# EAGLE design SwBotMain (EAGLE 6.3)
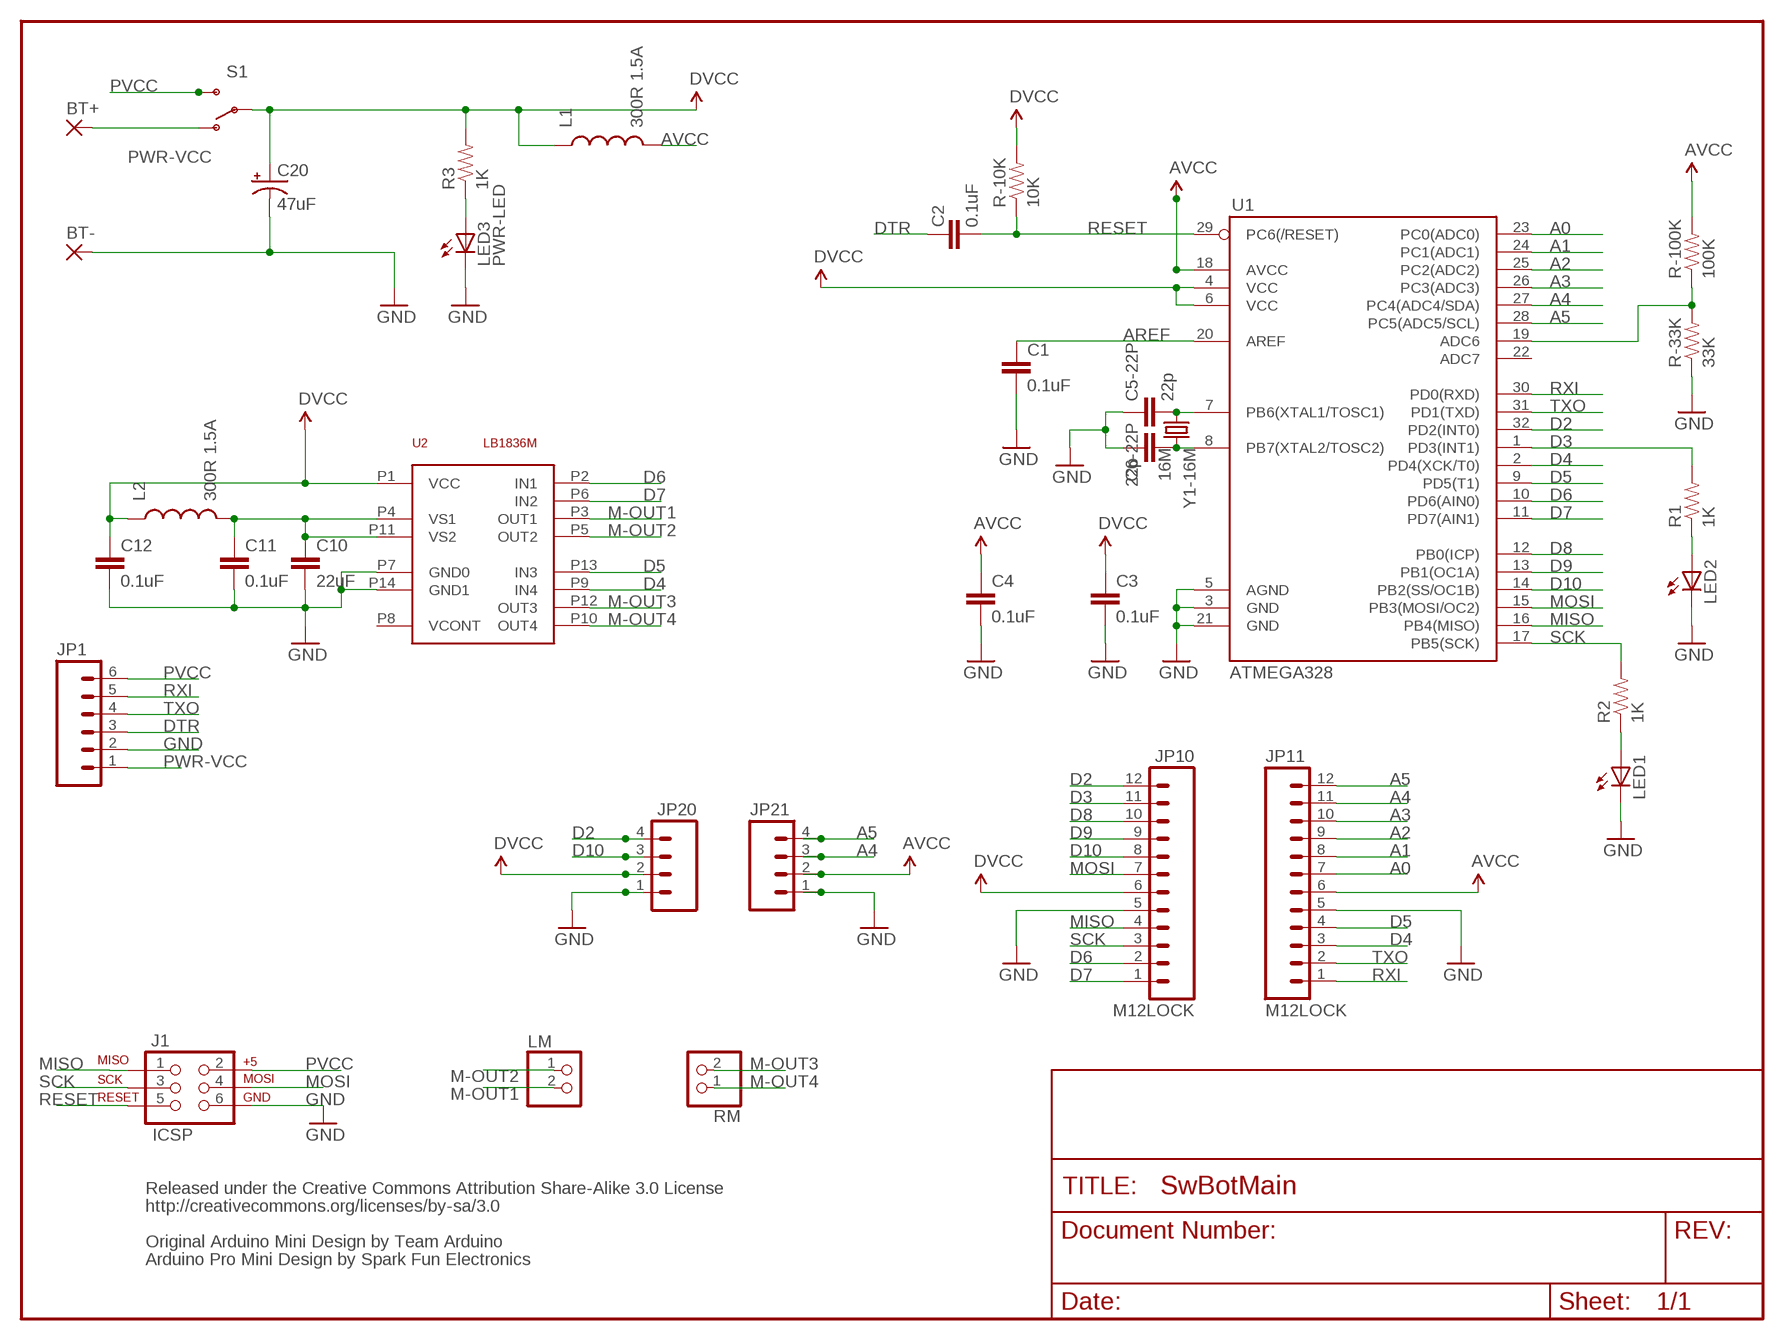
[diagram p0: schematic, sheet 1]

## Parts
BT+  SMD2  [SMD1,27-2,54]
BT-  SMD2  [SMD1,27-2,54]
C1  0.1uF  CAP0805  [0805]
C2  0.1uF  CAP0805  [0805]
C3  0.1uF  CAP0805  [0805]
C4  0.1uF  CAP0805  [0805]
C5-22P  22p  CAP0805  [0805]
C6-22P  22p  CAP0805  [0805]
C10  22uF  CAP1206  [1206]
C11  0.1uF  CAP0805  [0805]
C12  0.1uF  CAP0805  [0805]
C20  47uF  47UF-TANT  [EIA3528]
J1  ICSP  AVR_SPI_PRG_62X3_LOCK  [2X3_LOCK]
JP1  M06LOCK  [1X06_LOCK]
JP10  M12LOCK  [1X12_LOCK]
JP11  M12LOCK  [1X12_LOCK]
JP20  M04LOCK_LONGPADS  [1X04_LOCK_LONGPADS]
JP21  M04LOCK_LONGPADS  [1X04_LOCK_LONGPADS]
L1  300R 1.5A  INDUCTOR0805  [0805]
L2  300R 1.5A  INDUCTOR0805  [0805]
LED1  LEDCHIP-LED0805  [CHIP-LED0805]
LED2  LEDCHIP-LED0805  [CHIP-LED0805]
LED3  PWR-LED  LED5MM  [LED5MM]
LM  PINHD-1X2  [1X02]
R1  1K  RESISTOR0805-RES  [0805]
R2  1K  RESISTOR0805-RES  [0805]
R3  1K  RESISTOR0805-RES  [0805]
R-10K  10K  RESISTOR0805-RES  [0805]
R-33K  33K  RESISTOR0805-RES  [0805]
R-100K  100K  RESISTOR0805-RES  [0805]
RM  PINHD-1X2  [1X02]
S1  SWITCH-SPDTPTH_LOCK  [SWITCH-SPDT_LOCK.007S]
U1  ATMEGA328  ATMEGA168  [TQFP32-08]
U2  LB1836M  [MFP14S]
Y1-16M  16M  CRYSTALTXC-7A  [CRYSTAL-TXC-7A]

## Nets
A0: JP11.7 U1.23(PC0(ADC0))
A1: JP11.8 U1.24(PC1(ADC1))
A2: JP11.9 U1.25(PC2(ADC2))
A3: JP11.10 U1.26(PC3(ADC3))
A4: JP11.11 JP21.3 U1.27(PC4(ADC4/SDA))
A5: JP11.12 JP21.4 U1.28(PC5(ADC5/SCL))
AREF: C1.1 U1.20(AREF)
AVCC [vcc]: C4.1 JP11.6 JP21.2 L1.2 R-100K.2 U1.18(AVCC)
D2: JP10.12 JP20.4 U1.32(PD2(INT0))
D3: JP10.11 R1.2 U1.1(PD3(INT1))
D4: JP11.3 U1.2(PD4(XCK/T0)) U2.P9(IN4)
D5: JP11.4 U1.9(PD5(T1)) U2.P13(IN3)
D6: JP10.2 U1.10(PD6(AIN0)) U2.P2(IN1)
D7: JP10.1 U1.11(PD7(AIN1)) U2.P6(IN2)
D8: JP10.10 U1.12(PB0(ICP))
D9: JP10.9 U1.13(PB1(OC1A))
D10: JP10.8 JP20.3 U1.14(PB2(SS/OC1B))
DTR: C2.2 JP1.3
DVCC [vcc]: C3.1 C12.1 C20.A(+) JP10.6 JP20.2 L1.1 L2.1 R3.2 R-10K.2 S1.2(P) U1.4(VCC) U1.6(VCC) U2.P1(VCC)
GND [vcc]: BT-.1(P) C1.2 C3.2 C4.2 C5-22P.1 C6-22P.2 C10.2 C11.2 C12.2 C20.C(-) J1.6 JP1.2 JP10.5 JP11.5 JP20.1 JP21.1 LED1.C LED2.C LED3.K(C) R-33K.1 U1.3(GND) U1.5(AGND) U1.21(GND) U2.P7(GND0) U2.P14(GND1)
M-OUT1 [HighCur]: LM.2 U2.P3(OUT1)
M-OUT2 [HighCur]: LM.1 U2.P5(OUT2)
M-OUT3 [HighCur]: RM.2 U2.P12(OUT3)
M-OUT4 [HighCur]: RM.1 U2.P10(OUT4)
MISO: J1.1 JP10.4 U1.16(PB4(MISO))
MOSI: J1.4 JP10.7 U1.15(PB3(MOSI/OC2))
N$1: C6-22P.1 U1.8(PB7(XTAL2/TOSC2)) Y1-16M.P$2
N$2: C5-22P.2 U1.7(PB6(XTAL1/TOSC1)) Y1-16M.P$1
N$3: LED2.A R1.1
N$4: LED3.A R3.1
N$5 [vcc]: C10.1 C11.1 L2.2 U2.P4(VS1) U2.P11(VS2)
N$6: R-33K.2 R-100K.1 U1.19(ADC6)
N$7: LED1.A R2.1
PVCC [vcc]: J1.2 JP1.6 S1.3(S)
PWR-VCC [vcc]: BT+.1(P) JP1.1 S1.1(O)
RESET: C2.1 J1.5 R-10K.1 U1.29(PC6(/RESET))
RXI: JP1.5 JP11.1 U1.30(PD0(RXD))
SCK: J1.3 JP10.3 R2.2 U1.17(PB5(SCK))
TXO: JP1.4 JP11.2 U1.31(PD1(TXD))
Unconnected: U1.22(ADC7) U2.P8(VCONT)

## Notes on the sheet
- Released under the Creative Commons Attribution Share-Alike 3.0 License
- http://creativecommons.org/licenses/by-sa/3.0
- Original Arduino Mini Design by Team Arduino
- Arduino Pro Mini Design by Spark Fun Electronics

## Library data of the parts
BT+ BT- = wirepad:SMD2: SMD PAD
C1 C3 C4 C5-22P C6-22P C10-C12 = SparkFun-Capacitors:CAP: Capacitor Standard 0603 ceramic capacitor, and 0.1" leaded capacitor.
C2 = SparkFun:CAP: Capacitor Standard 0603 ceramic capacitor, and 0.1" leaded capacitor.
C20 = SparkFun-Capacitors:47UF-TANT: 47uF Tantalum SMT CAP-08310- 10V 10% (EIA-3528); PROD_ID: CAP-08310
J1 = SparkFun-Connectors:AVR_SPI_PRG_6: AVR ISP 6 Pin This is the reduced ISP connector for AVR programming. Common on Arduino. This footprint will take up less PCB space and can be used with a 10-pin to 6-pin adapter such as SKU: BOB-08508
JP1 = SparkFun-Connectors:M06: Header 6 Standard 6-pin 0.1" header. Use with straight break away headers (SKU : PRT-00116), right angle break away headers (PRT-00553), swiss pins (PRT-00743), machine pins (PRT-00117), and female headers (PRT-00115). Molex polarized connector foot print use with SKU : PRT-08094 with associated crimp pins and housings. NOTES ON THE VARIANTS LOCK and LOCK_LONGPADS... This footprint was designed to help hold the alignment of a through-hole component (i.e. 6-pin header) while soldering it into place. You may notice that each hole has been shifted either up or down by 0.005 of an inch from it's more standard position (which is a perfectly straight line). This slight alteration caused the pins (the squares in the middle) to touch the edges of the holes. Because they are alternating, it causes a "brace" to hold the component in place. 0.005 has proven to be the perfect amount of "off-center" position when using our standard breakaway headers. Although looks a little odd when you look at the bare footprint, once you have a header in there, the alteration is very hard to notice. Also, if you push a header all the way into place, it is covered up entirely on the bottom side. This idea of altering the position of holes to aid alignment will be further integrated into the Sparkfun Library for other footprints. It can help hold any component with 3 or more connection pins.
JP10 JP11 = SparkFun-Connectors:M12: Header 12 Standard 12-pin 0.1" header. Use with straight break away headers (SKU : PRT-00116), right angle break away headers (PRT-00553), swiss pins (PRT-00743), machine pins (PRT-00117), and female headers (PRT-00115).
JP20 JP21 = SparkFun-Connectors:M04: Header 4 Standard 4-pin 0.1" header. Use with straight break away headers (SKU : PRT-00116), right angle break away headers (PRT-00553), swiss pins (PRT-00743), machine pins (PRT-00117), and female headers (PRT-00115). Molex polarized connector foot print use with SKU : PRT-08231 with associated crimp pins and housings. 1MM SMD Version SKU: PRT-10208
L1 L2 = SparkFun-Passives:INDUCTOR: Inductors Basic Inductor/Choke - 0603 and 1206. Footprints are not proven and vary greatly between part numbers.
LED1 LED2 = led:LED: LED OSRAM: - CHIPLED LG R971, LG N971, LY N971, LG Q971, LY Q971, LO R971, LY R971 LH N974, LH R974 LS Q976, LO Q976, LY Q976 LO Q996 - Hyper CHIPLED LW Q18S LB Q993, LB Q99A, LB R99A - SideLED LS A670, LO A670, LY A670, LG A670, LP A670 LB A673, LV A673, LT A673, LW A673 LH A674 LY A675 LS A676, LA A676, LO A676, LY A676, LW A676 LS A679, LY A679, LG A679 - Hyper Micro SIDELED® LS Y876, LA Y876, LO Y876, LY Y876 LT Y87S - SmartLED LW L88C, LW L88S LB L89C, LB L89S, LG L890 LS L89K, LO L89K, LY L89K LS L896, LA L896, LO L896, LY L896 - TOPLED LS T670, LO T670, LY T670, LG T670, LP T670 LSG T670, LSP T670, LSY T670, LOP T670, LYG T670 LG T671, LOG T671, LSG T671 LB T673, LV T673, LT T673, LW T673 LH T674 LS T676, LA T676, LO T676, LY T676, LB T676, LH T676, LSB T676, LW T676 LB T67C, LV T67C, LT T67C, LS T67K, LO T67K, LY T67K, LW E67C LS E67B, LA E67B, LO E67B, LY E67B, LB E67C, LV E67C, LT E67C LW T67C LS T679, LY T679, LG T679 LS T770, LO T770, LY T770, LG T770, LP T770 LB T773, LV T773, LT T773, LW T773 LH T774 LS E675, LA E675, LY E675, LS T675 LS T776, LA T776, LO T776, LY T776, LB T776 LHGB T686 LT T68C, LB T68C - Hyper Mini TOPLED® LB M676 - Mini TOPLED Santana® LG M470 LS M47K, LO M47K, LY M47K Source: http://www.osram.convergy.de LUXEON: - LUMILED® LXK2-PW12-R00, LXK2-PW12-S00, LXK2-PW14-U00, LXK2-PW14-V00 LXK2-PM12-R00, LXK2-PM12-S00, LXK2-PM14-U00 LXK2-PE12-Q00, LXK2-PE12-R00, LXK2-PE12-S00, LXK2-PE14-T00, LXK2-PE14-U00 LXK2-PB12-K00, LXK2-PB12-L00, LXK2-PB12-M00, LXK2-PB14-N00, LXK2-PB14-P00, LXK2-PB14-Q00 LXK2-PR12-L00, LXK2-PR12-M00, LXK2-PR14-Q00, LXK2-PR14-R00 LXK2-PD12-Q00, LXK2-PD12-R00, LXK2-PD12-S00 LXK2-PH12-R00, LXK2-PH12-S00 LXK2-PL12-P00, LXK2-PL12-Q00, LXK2-PL12-R00 Source: www.luxeon.com KINGBRIGHT: KA-3528ASYC Source: www.kingbright.com
LED3 = SparkFun-LED:LED: LEDs Standard schematic elements and footprints for 5mm, 3mm, 1206, and 0603 sized LEDs. 5mm - Spark Fun Electronics SKU : COM-00529 (and others)
LM RM = pinhead:PINHD-1X2: PIN HEADER
R1-R3 R-10K R-33K R-100K = SparkFun-Passives:RESISTOR: Resistor Basic schematic elements and footprints for 0603, 1206, and PTH resistors.
S1 = SparkFun-Electromechanical:SWITCH-SPDT: SPST Switch Simple slide switch. Spark Fun Electronics SKU : COM-00102
U1 = SparkFun:ATMEGA168
U2 = LeoBuild:LB1836M
Y1-16M = SparkFun-FreqCtrl:CRYSTAL: Various standard crystals. Proven footprints. Spark Fun Electronics SKU : COM-00534

## Net classes
0 default: width 0.203 mm
1 vcc: width 0.406 mm
2 HighCur: width 0.406 mm

## Board
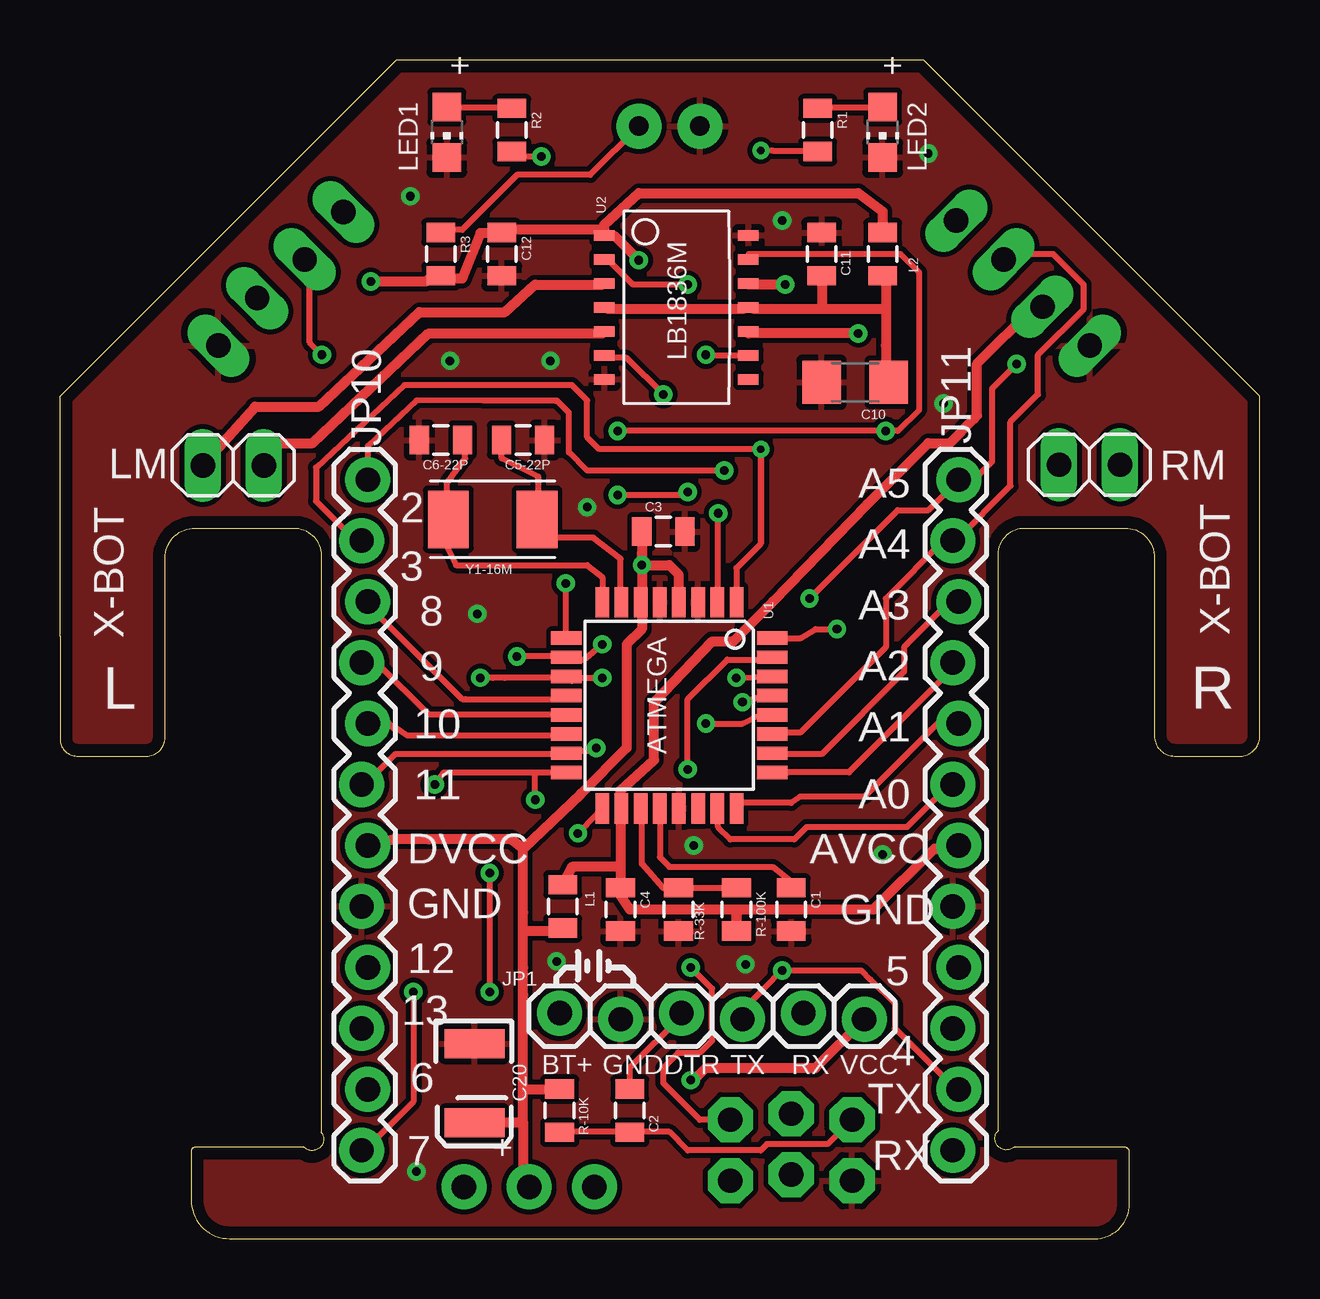
[diagram p1: board, top side]
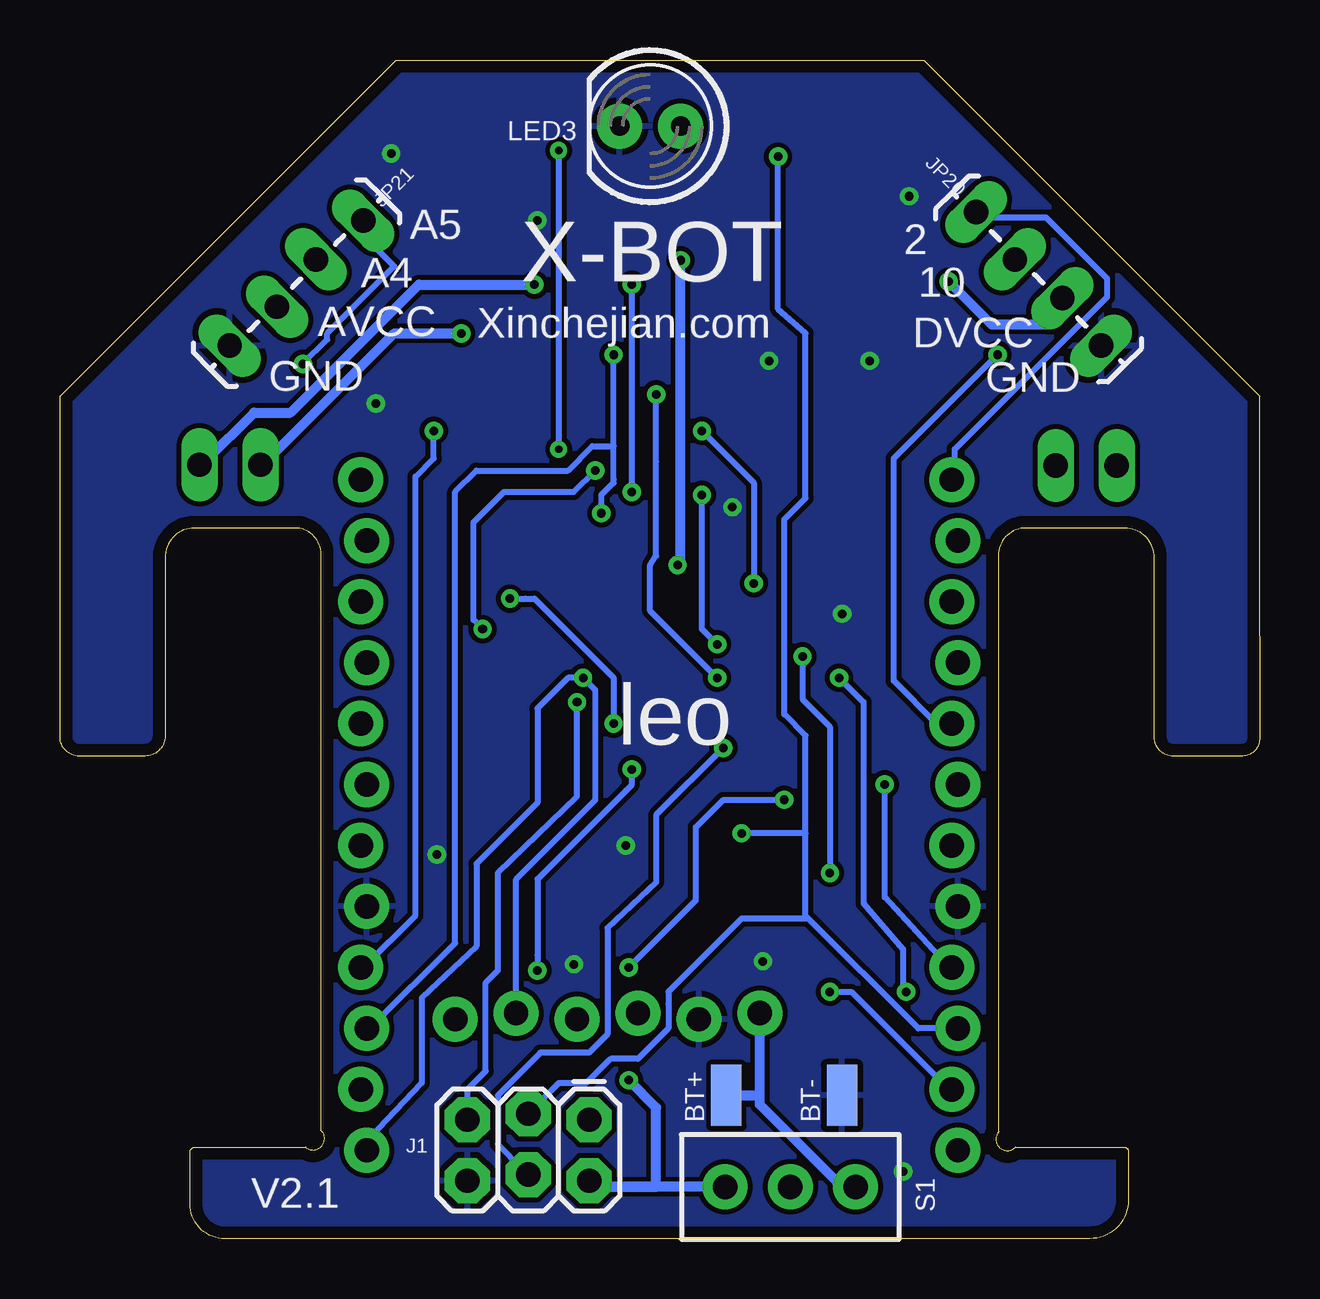
[diagram p2: board, bottom side, seen from below]

Size 50 x 49.11 mm. Coordinates in mm from the lower left corner, seen from the top.
Outline: 39.12,4.51 39.12,28.52 arc-90 40.21,29.61 44.39,29.61 arc-90 45.62,28.38 45.62,26.11 45.62,24.61 45.62,20.95 arc90 46.45,20.11 49.04,20.11 arc90 50,20.82 50,35.11 36,49.11 35,49.11 14,49.11 0,35.11 0,25.11 0,20.82 arc90 0.71,20.11 1.88,20.11 3.67,20.11 arc90 4.38,20.95 4.38,28.36 arc-90 5.63,29.61 9.74,29.61 arc-90 10.88,28.48 10.88,16.24 10.88,4.38
Outline: 39.77,3.82 arc-180 39.12,4.51
Outline: 39.75,3.81 44.37,3.81 arc-90 44.58,3.6 44.58,1.45 arc-90 43.13,0 7.08,0 arc-90 5.46,1.62 5.46,3.63 arc-90 5.64,3.81 10.16,3.81
Outline: 10.86,4.46 arc-180 10.17,3.82
Copper layers (1*16): Top 0.035mm / dielectric 1.5mm / Bottom 0.035mm
Design rules "default *": minimum track width 10mil, minimum drill 12mil, track to track 8mil, track to pad 8mil, pad to pad 8mil, via to via 8mil, smd to smd 8mil, copper to edge 20mil, drill to drill 8mil, minimum pad ring 10mil, minimum via ring 8mil, stop-mask expansion 4mil, vias tented up to drill 0mil, thermal gap 10mil

### Footprints (pad centres in the part's own frame; a part is rotated, then mirrored left to right if it is on the bottom)
SMD1,27-2,54 = smd 1.27 x 2.54: 1 0,0
0805 = smd 0.8 x 1.2: 1 -0.9,0; 2 0.9,0
1206 = smd 1.6 x 1.8: 1 -1.4,0; 2 1.4,0
EIA3528 = smd 1.2 x 2.5: A 1.65,0; C -1.65,0
2X3_LOCK = drill 1.016 pad 1.88 octagon: 1 0,0; 2 0,2.54; 3 2.54,-0.254; 4 2.54,2.286; 5 5.08,0; 6 5.08,2.54
1X06_LOCK = drill 1.016 pad 1.88: 1 0,0; 2 2.54,-0.254; 3 5.08,0; 4 7.62,-0.254; 5 10.16,0; 6 12.7,-0.254
1X12_LOCK = drill 1.016 pad 1.88: 1 0,0.127; 2 2.54,-0.127; 3 5.08,0.127; 4 7.62,-0.127; 5 10.16,0.127; 6 12.7,-0.127; 7 15.24,0.127; 8 17.78,-0.127; 9 20.32,0.127; 10 22.86,-0.127; 11 25.4,0.127; 12 27.94,-0.127
1X04_LOCK_LONGPADS = drill 1.016 long: 1 0,0; 2 2.54,-0.254; 3 5.08,0; 4 7.62,-0.254
CHIP-LED0805 = smd 1.2 x 1.2: A 0,-1.05; C 0,1.05
LED5MM = drill 0.813 pad 1.88: A -1.27,0; K 1.27,0
1X02 = drill 1.016 long: 1 -1.27,0; 2 1.27,0
SWITCH-SPDT_LOCK.007S = drill 1.016 pad 1.88: 1 0,2.718; 2 0,0; 3 0,-2.718
TQFP32-08 = smd 1.27 x 0.559: 1 -4.293,2.8; 2 -4.293,2; 3 -4.293,1.2; 4 -4.293,0.4; 5 -4.293,-0.4; 6 -4.293,-1.2; 7 -4.293,-2; 8 -4.293,-2.8; 17 4.293,-2.8; 18 4.293,-2; 19 4.293,-1.2; 20 4.293,-0.4; 21 4.293,0.4; 22 4.293,1.2; 23 4.293,2; 24 4.293,2.8 | smd 0.559 x 1.27: 9 -2.8,-4.293; 10 -2,-4.293; 11 -1.2,-4.293; 12 -0.4,-4.293; 13 0.4,-4.293; 14 1.2,-4.293; 15 2,-4.293; 16 2.8,-4.293; 25 2.8,4.293; 26 2,4.293; 27 1.2,4.293; 28 0.4,4.293; 29 -0.4,4.293; 30 -1.2,4.293; 31 -2,4.293; 32 -2.8,4.293
MFP14S = smd 0.45 x 0.85: P1 1,-0.8; P2 2,-0.8; P3 3,-0.8; P4 4,-0.8; P5 5,-0.8; P6 6,-0.8; P7 7,-0.8; P8 7,5.2; P9 6,5.2; P10 5,5.2; P11 4,5.2; P12 3,5.2; P13 2,5.2; P14 1,5.2
CRYSTAL-TXC-7A = smd 1.7 x 2.4: P$1 1.85,0; P$2 -1.85,0

### Placement (x,y rotation side)
BT+  22.23,5.97 0 bottom
BT-  17.4,5.97 0 bottom
C1  30.48,13.72 270 top
C2  23.75,5.33 90 top
C3  25.15,29.46 0 top
C4  23.37,13.72 270 top
C5-22P  19.3,33.27 180 top
C6-22P  15.88,33.27 180 top
C10  33.15,35.69 180 top
C11  31.75,41.02 90 top
C12  18.41,41.02 270 top
C20  17.27,6.48 270 top
J1  27.94,4.95 180 bottom
JP1  20.83,9.4 0 top
JP10  12.7,3.68 90 top
JP11  37.34,3.68 90 top
JP20  6.6,37.21 135 bottom
JP21  42.93,37.21 45 bottom
L1  20.95,13.84 90 top
L2  34.29,41.02 270 top
LED1  16.13,46.1 180 top
LED2  34.29,46.1 180 top
LED3  25.4,46.35 180 bottom
LM  7.22,32.22 180 top
R1  31.58,46.2 270 top
R2  18.84,46.2 270 top
R3  15.88,41.02 270 top
R-10K  20.83,5.33 90 top
R-33K  25.78,13.72 90 top
R-100K  28.19,13.72 270 top
RM  42.91,32.25 0 top
S1  19.56,2.16 270 bottom
U1  25.4,22.23 270 top
U2  23.5,42.8 270 top
Y1-16M  18.03,29.97 0 top

### Tracks (layer width: path | path; a pad name or v marks a point on that pad's centre or on a via)
A0
  Top 0.254: U1.23 27.43,17.4 27.43,17.14 27.94,16.64 30.61,16.64 31.11,17.14 35.31,17.14 36.83,18.67 37.08,18.92 JP11.7
A1
  Top 0.254: 36.32,21.21 36.45,21.34 36.32,21.21 | 36.32,21.21 33.53,18.41 30.86,18.41 30.48,18.16 28.32,18.16 U1.24 | 36.32,21.21 36.58,21.46 JP11.8
A2
  Top 0.254: 36.96,23.5 36.89,23.43 | 36.89,23.43 32.89,19.43 30.35,19.43 U1.25 | JP11.9 37.08,24 37.08,23.75 36.83,23.5 36.89,23.43
A3
  Top 0.254: 37.34,26.54 36.64,26.1 | 36.64,26.1 35.18,24.64 35.18,23.62 31.75,20.19 30.23,20.19 U1.26 | 37.34,26.54 JP11.10 | 37.34,26.54 36.64,26.1
A4
  Top 0.254: U1.27 30.23,21.08 30.86,21.08 34.42,24.64 34.42,26.67 36.83,29.08 JP11.11 37.34,29.08 39.62,31.37 39.62,34.04 40.77,35.18 40.77,36.83 42.67,38.73 42.67,39.75 41.4,41.02 39.37,41.02 JP21.3
A5  (via drill 0.36)
  Top 0.254: v26.92,21.46 28.45,21.46 29.21,21.84 U1.28 | v31.24,26.67 34.92,30.35 36.2,30.35 JP11.12 | JP11.12 37.21,31.62 JP11.12 | v39.88,36.45 38.86,35.43 38.86,32.38 38.1,31.62 37.59,31.62 JP11.12
  Bottom 0.254: v26.92,21.46 26.92,23.37 30.23,26.67 30.61,26.67 v31.24,26.67 | v39.88,36.45 38.86,37.46 38.86,37.72 36.07,40.51 37.34,41.78 37.34,42.29 JP21.4
AREF
  Top 0.254: U1.20 25,15.89 25.4,15.49 29.72,15.49 30.48,14.87 C1.1
AVCC
  Top 0.406: 23.37,15.49 21.34,15.49 L1.2 | 23.37,15.49 C4.1 | 23.37,15.49 23.37,17.65 U1.18 23.37,17.91 23.37,18.67 24.77,19.94 24.77,22.35 27.18,24.89 28.07,24.89 29.46,26.29 29.72,26.54 33.66,30.61 36.2,33.15 37.08,33.15 38.1,34.16 38.23,34.29 38.23,36.45 40.6,38.83 JP21.2 | 23.37,15.49 C4.1 | C4.1 23.37,14.61 23.24,14.48 23.75,13.72 28.19,13.72 | 28.19,13.72 R-100K.2 28.19,13.72 | 28.19,13.72 33.91,13.72 36.45,16.26 37.34,16.26 JP11.6
D2  (via drill 0.36)
  Top 0.254: U1.32 30.87,25.03 31.5,25.4 v32.38,25.4 | v27.69,32 22.1,32 21.97,32 21.21,32.77 21.21,34.42 20.7,34.92 20.68,34.91 | 20.68,34.91 14.86,34.92 12.83,33.02 JP10.12 | 17.65,34.92 20.68,34.91
  Bottom 0.254: v32.38,25.4 32.77,25.78 32.77,29.85 31.5,31.11 31.37,31.11 28.57,31.11 v27.69,32 | JP20.4 11.68,42.54 8.89,42.54 6.35,40 6.35,39.24 12.7,32.89 12.7,31.62 JP10.12
D3  (via drill 0.3)
  Top 0.254: R1.2 31.5,45.34 29.72,45.34 v29.21,45.34 | v29.21,32.89 29.21,28.96 | 29.21,28.96 28.19,27.94 | 28.19,27.94 28.19,26.42 U1.1 | 28.19,27.94 29.21,28.96 | 29.21,28.96 v29.21,32.89 | v29.21,32.89 22.48,32.89 21.97,33.4 21.97,34.92 21.34,35.56 14.35,35.56 10.67,32.13 10.67,30.73 12.32,29.08 JP10.11
  Bottom 0.254: v29.21,45.34 v29.21,32.89
D4  (via drill 0.36)
  Top 0.254: U1.2 27.43,26.3 v27.43,30.23 | v26.92,36.83 26.95,36.8 U2.P9
  Bottom 0.254: JP11.3 37.08,8.76 33.53,12.32 33.53,31.11 32.64,32 28.83,32 27.81,33.02 26.92,33.02 | v27.43,30.23 27.43,30.99 26.92,31.5 26.92,31.62 26.92,33.02 | 26.92,33.02 v26.92,36.83
D5  (via drill 0.36)
  Top 0.254: 20.95,25.15 U1.9 21.08,24.89 v21.08,27.3 | U2.P13 28.7,41.02 35.05,41.02 35.81,40.26 35.81,34.54 34.92,33.65 v34.42,33.65 v23.24,33.65
  Bottom 0.254: v34.42,33.65 34.42,32.51 35.18,31.75 35.18,13.46 37.34,11.3 JP11.4 | v21.08,27.3 21.08,31.5 v23.24,33.65
D6  (via drill 0.36)
  Top 0.254: v26.16,39.75 23.88,39.75 22.86,40.77 U2.P2 | v26.16,31.11 26.04,30.99 v23.24,30.99 | v22.61,24.77 21.84,24.13 21.34,24.13 U1.10 21.08,24.26 v19.05,24.26 | v17.91,10.29 17.91,14.99 v17.91,15.24
  Bottom 0.254: v26.16,39.75 26.16,32.26 v26.16,31.11 | v23.24,30.99 23.24,25.4 v22.61,24.77 | v17.91,10.29 17.02,10.29 12.95,6.22 JP10.2 | v17.91,15.24 17.91,21.34 19.05,22.48 v19.05,24.26
D7  (via drill 0.36)
  Top 0.254: v25.15,35.18 23.62,36.7 22.86,36.7 U2.P6 | v22.61,23.37 22.1,23.37 21.59,23.37 21.34,23.24 U1.11 20.95,23.37 18.54,23.37 18.03,23.37 v17.53,23.37 | v14.73,10.29 14.73,5.71 12.7,3.68 JP10.1
  Bottom 0.254: v25.15,35.18 25.15,32.38 25.15,28.45 25.4,28.07 25.4,26.16 v22.61,23.37 | v14.73,10.29 14.86,10.54 14.86,11.05 14.86,12.07 16.51,13.97 16.51,22.35 v17.53,23.37
D8
  Top 0.254: U1.12 20.83,22.48 16.89,22.48 16.76,22.48 12.7,26.54 JP10.10
D9
  Top 0.254: U1.13 20.83,21.84 15.37,21.84 13.21,24 JP10.9
D10  (via drill 0.36)
  Top 0.254: U1.14 20.83,20.96 14.48,20.96 13.99,21.29 | 13.99,21.29 13.84,21.34 | JP10.8 12.95,21.46 13.72,21.46 13.97,21.21 13.99,21.29 | v10.92,36.83 10.41,37.34 10.41,40.77 JP20.3
  Bottom 0.254: v10.92,36.83 13.46,34.29 14.22,33.53 15.24,32.51 15.24,23.24 13.46,21.46 12.95,21.46 JP10.8
DTR
  Top 0.254: C2.2 23.75,6.6 23.75,7.11 25.91,9.27 JP1.3
DVCC  (via drill 0.36)
  Top 0.406: 20.95,13.08 L1.1 20.95,12.83 19.3,12.83 | C3.1 24.26,29.59 24.26,28.57 | 24.26,28.57 v24.26,28.07 | v24.26,28.07 24.26,26.33 U1.6 24.26,26.04 24.26,25.4 23.62,24.77 23.62,20.45 21.72,18.54 19.3,16.26 | 22.7,42.04 U2.P1 22.86,41.78 23.11,41.78 v24.13,40.77 | 22.7,42.04 22.7,42.25 24.13,43.56 33.27,43.56 34.29,42.8 L2.1 | 22.7,42.04 22.61,42.04 18.54,42.04 C12.1 17.53,41.91 16.76,40 16.26,40 16.13,40 R3.2 15.75,40.26 15.24,39.88 v12.95,39.88 | v24.26,28.07 25.4,28.07 25.78,27.69 25.78,26.42 U1.4 | v24.26,28.07 24.26,28.57 | 19.3,6.22 20.45,6.22 R-10K.2 | 19.3,4.83 19.3,6.22 | 19.3,4.83 C20.A 19.3,4.83 | 19.3,11.3 19.3,12.83 | 19.3,11.3 19.3,10.16 19.3,6.22 | 19.3,16.26 18.8,16.64 15.37,16.64 13.97,16.64 12.95,16.38 JP10.6 | 19.3,11.3 19.3,12.83 | 19.3,12.83 19.3,13.59 19.3,16.26 | 19.3,4.83 19.3,2.79 19.94,2.16 S1.2
  Bottom 0.406: v24.13,40.77 24.13,28.07 v24.26,28.07 | v12.95,39.88 11.18,38.1 8.89,38.1 8.38,38.99 JP20.2
GND  (via drill 0.36)
  Top 0.406: 16.26,45.08 LED1.C 16,45.08 16,45.18 | 16.26,45.08 | 14.99,33.4 C6-22P.2 14.99,33.4 | 14.99,33.4 14.9,33.35 14.99,33.4 | 23.11,9.02 JP1.2 | 26.16,29.34 C3.2 | 26.16,29.34 26.12,29.34 | 26.16,29.34 26.12,29.34 | 26.16,29.34 26.12,29.34 | 26.67,26.29 26.61,26.29 | 26.67,26.29 26.61,26.29 | 26.67,26.29 26.61,26.29 | 26.67,26.29 26.61,26.29 | 20.32,33.15 20.28,33.2 20.32,33.15
  other vias: 17.4,26.04 28.57,11.43 20.7,11.56 14.86,2.79 26.42,16.38 21.97,30.48 20.45,36.58 14.61,43.43 36.2,45.21 30.1,42.42 34.29,16 36.83,34.8 16.26,36.58
  pour Bottom: 0,48.77 49.91,48.89 49.66,-0.38 0.13,-0.38
  pour Top: 0.25,-0.38 49.66,-0.38 49.91,48.89 0.13,48.77
M-OUT1
  Top 0.406: U2.P3 22.61,39.75 19.81,39.75 18.54,38.61 14.99,38.61 10.79,34.67 8.13,34.67 6.1,32.38 LM.2
M-OUT2
  Top 0.406: U2.P5 22.61,37.72 15.37,37.72 10.54,33.15 8.89,33.15 LM.1
M-OUT3  (via drill 0.36)
  Top 0.406: v30.23,39.75 28.7,39.75 U2.P12
  Bottom 0.406: v30.23,39.75 35.05,39.75 40.39,34.42 41.91,34.42 43.94,32.38 RM.2
M-OUT4  (via drill 0.36)
  Top 0.406: v33.27,37.72 28.7,37.72 U2.P10
  Bottom 0.406: v33.27,37.72 36.07,37.72 41.4,32.38 RM.1
MISO  (via drill 0.36)
  Top 0.254: v15.62,18.92 16,19.43 19.81,19.43 | 19.81,19.43 21.08,19.43 U1.16 | J1.1 26.67,4.95 25.15,6.48 25.15,7.11 25.27,7.24 25.78,7.75 26.67,7.75 27.18,8.26 27.18,10.41 v26.29,11.3 | v19.81,18.29 19.81,19.43
  Bottom 0.254: v15.62,18.92 15.62,14.22 12.95,11.3 JP10.4 | v26.29,11.3 23.5,14.1 23.5,17.14 22.35,18.29 v19.81,18.29
MOSI  (via drill 0.36)
  Top 0.254: 20.83,20.19 U1.15 | JP10.7 12.7,18.92 13.97,20.19 20.83,20.19 | 20.83,20.19 U1.15 | v22.35,20.45 22.1,20.32 21.59,20.32 21.34,20.19 U1.15
  Bottom 0.254: J1.4 30.73,2.92 31.75,3.94 31.75,5.97 29.97,7.75 27.94,7.75 27.18,8.51 27.18,12.95 25.15,14.86 25.15,17.65 v22.35,20.45
N$1
  Top 0.254: C6-22P.1 16.76,33.4 16.89,33.15 16.89,32.51 16.13,31.5 16.13,30.86 16.26,30.61 Y1-16M.P$2 15.88,29.34 16.51,28.07 21.97,28.07 22.61,27.56 U1.8
N$2
  Top 0.254: U1.7 23.4,26.64 23.37,26.67 23.37,28.32 22.23,29.21 20.57,29.21 19.88,29.9 Y1-16M.P$1 19.94,30.61 19.94,31.75 18.41,32.51 18.41,33.15 C5-22P.2
N$3
  Top 0.254: R1.1 31.75,47.12 34.29,47.12 LED2.A
N$4
  Top 0.254: LED3.A 22.1,44.32 19.05,44.32 16.76,42.04 16,42.04 R3.1
N$5
  Top 0.406: U2.P4 22.86,38.73 28.45,38.73 U2.P11 28.96,38.73 31.75,38.73 | 34.42,38.73 34.42,39.88 L2.2 | 34.42,38.73 34.42,37.21 34.42,35.69 34.42,35.56 34.54,35.56 C10.1 | 34.42,38.73 31.75,38.73 | C11.1 31.75,38.73
N$6
  Top 0.254: 24.26,17.65 U1.19 24.26,17.65 | 25.15,14.61 R-33K.2 | R-33K.2 25.91,14.61 28.19,14.61 R-100K.1 | 24.26,17.65 24.26,15.62 25.15,14.61 | 25.15,14.61 R-33K.2
N$7
  Top 0.254: LED1.A 16.26,47.12 18.8,47.12 R2.1
PVCC  (via drill 0.36)
  Top 0.406: v26.29,6.6 26.42,6.6 26.92,7.11 31.5,7.11 JP1.6
  Bottom 0.406: S1.3 25.15,2.16 | 25.15,2.16 27.69,2.16 | 27.69,2.16 27.69,2.29 | 27.69,2.29 J1.2 27.69,2.29 | 27.69,2.29 27.69,2.16 | 27.69,2.16 25.15,2.16 | 25.15,2.16 25.15,5.46 v26.29,6.6
PWR-VCC
  Bottom 0.406: S1.1 17.4,2.16 20.83,5.59 20.83,5.97 | 20.83,5.97 JP1.1 | BT+.1 20.83,5.97
RESET  (via drill 0.36)
  Top 0.254: R-10K.1 20.83,4.44 23.62,4.44 C2.1 24.13,4.44 25.4,4.44 26.16,3.68 29.21,3.68 29.46,3.94 32,3.94 J1.5 | v28.45,22.35 29.21,22.61 U1.29
  Bottom 0.254: v28.45,22.35 28.45,18.41 31.75,15.24 31.75,12.95 31.75,11.18 32.26,10.67 32.26,6.98 33.02,6.22 J1.5
RXI  (via drill 0.36)
  Top 0.254: v28.19,23.37 28.45,23.37 U1.30
  Bottom 0.254: JP1.5 30.99,9.53 30.99,14.99 27.69,18.29 27.69,22.86 v28.19,23.37 28.83,23.37 30.1,22.1 30.1,18.16 32.64,15.62 32.64,12.19 34.92,10.03 34.92,6.48 37.08,4.19 37.08,3.68 JP11.1
SCK  (via drill 0.36)
  Top 0.254: v20.07,45.08 19.05,45.08 R2.2 | v21.59,16.89 22.35,17.65 U1.17
  Bottom 0.254: v20.07,45.08 20.07,38.73 18.92,37.72 18.92,30.86 19.81,29.97 19.81,21.84 18.92,20.96 18.92,16.89 | 18.92,13.34 18.92,13.46 14.22,8.76 12.7,8.76 JP10.3 | 18.92,13.34 18.92,16.89 | 18.92,16.89 v21.59,16.89 | J1.3 29.21,6.48 28.07,6.48 27.05,7.49 25.91,7.49 24.64,8.76 24.64,9.78 24.64,10.29 21.59,13.34 18.92,13.34
TXO  (via drill 0.36)
  Top 0.254: v26.16,19.56 26.16,22.48 27.81,24.13 29.46,24.13 U1.31 | JP11.2 37.34,6.22 34.8,8.76 34.8,9.78 33.78,10.79 33.4,11.18 v30.1,11.18 29.34,10.41 28.32,9.4 28.45,9.27 JP1.4
  Bottom 0.254: v26.16,19.56 26.16,18.92 26.42,18.67 30.1,14.99 30.1,11.81 v30.1,11.18

### Text on the board
tPlace: + | + | A5 | 2 | A4 | 3 | A3 | X-BOT | 8 | X-BOT | 9 | A2 | L | R | 10 | A1 | ATMEGA | 11 | A0 | DVCC | AVCC | GND | GND | 12 | 5 | 13 | BT+ | GND | DTR | TX | RX | VCC | 4 | 6 | TX | 7 | + | RX
bPlace: A5 | 2 | X-BOT | A4 | 10 | DVCC | Xinchejian.com | AVCC | GND | GND | leo | V2.1